# Altium schematic sheet SL_Block_Diagram_ver_1.6.SchDoc
size A4
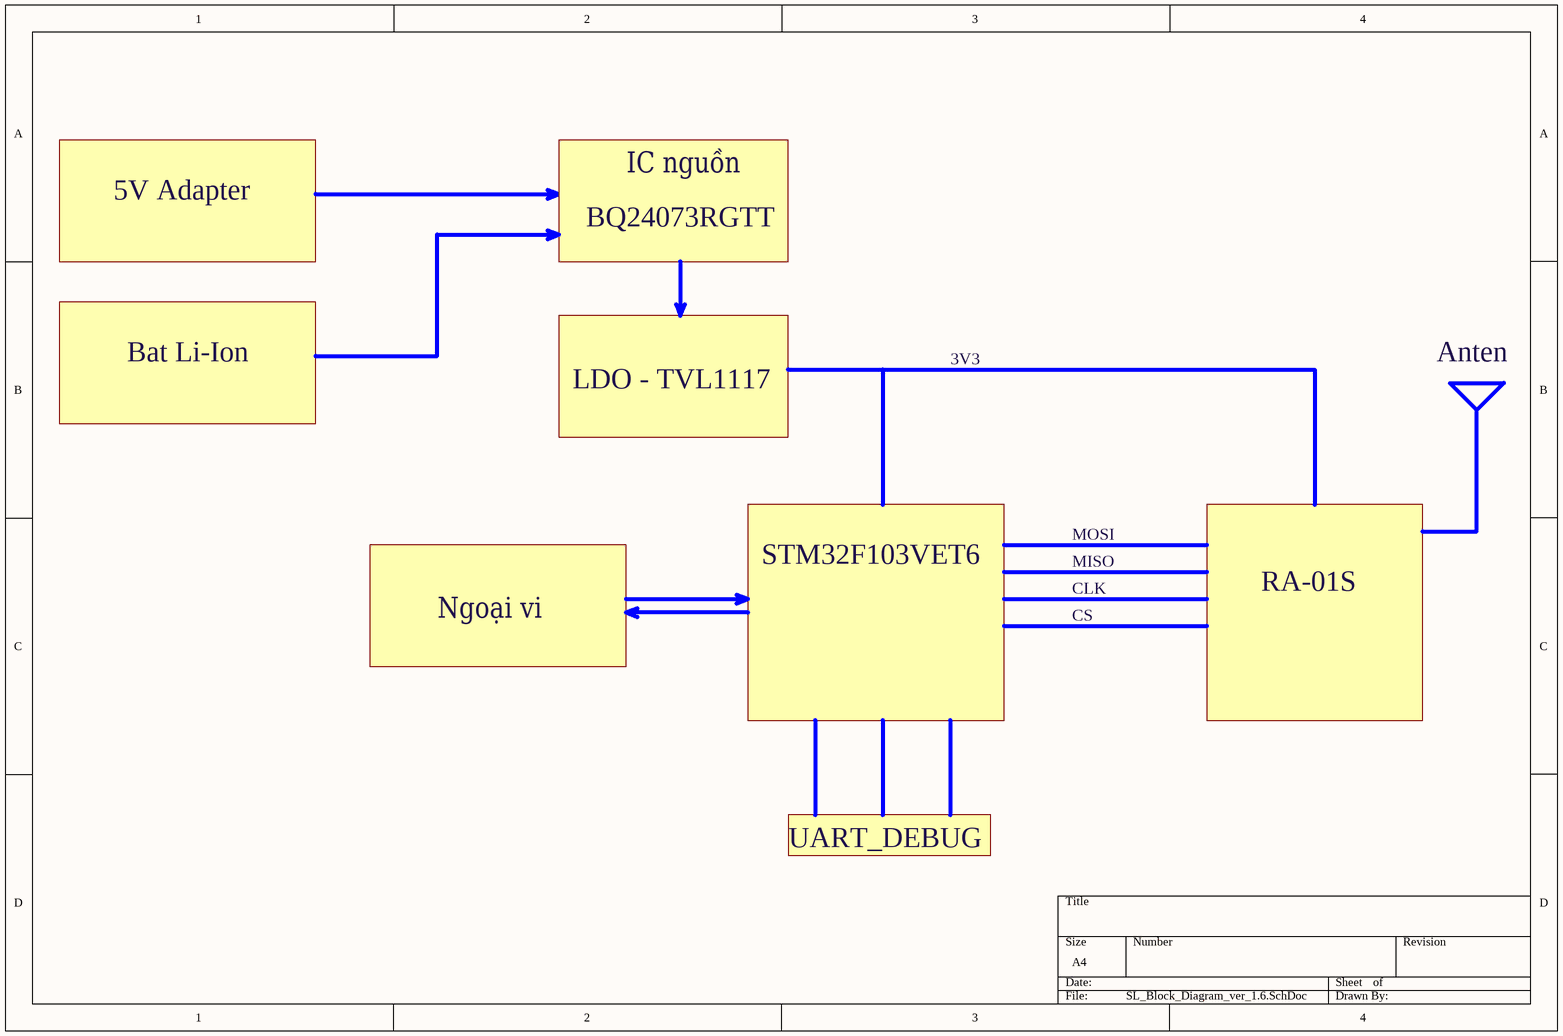
[diagram p0: SL_Block_Diagram_ver_1.6.SchDoc]

## Notes on the sheet
- IC nguồn
- 5V Adapter
- BQ24073RGTT
- Bat Li-Ion
- 3V3
- Anten
- LDO - TVL1117
- STM32F103VET6
- MOSI
- MISO
- Ngoại vi
- CLK
- CS
- RA-01S
- UART_DEBUG